# Altium schematic sheet 4.RK3588_GND.SchDoc
size A4; SheetNumber: 4; SheetTotal: 21
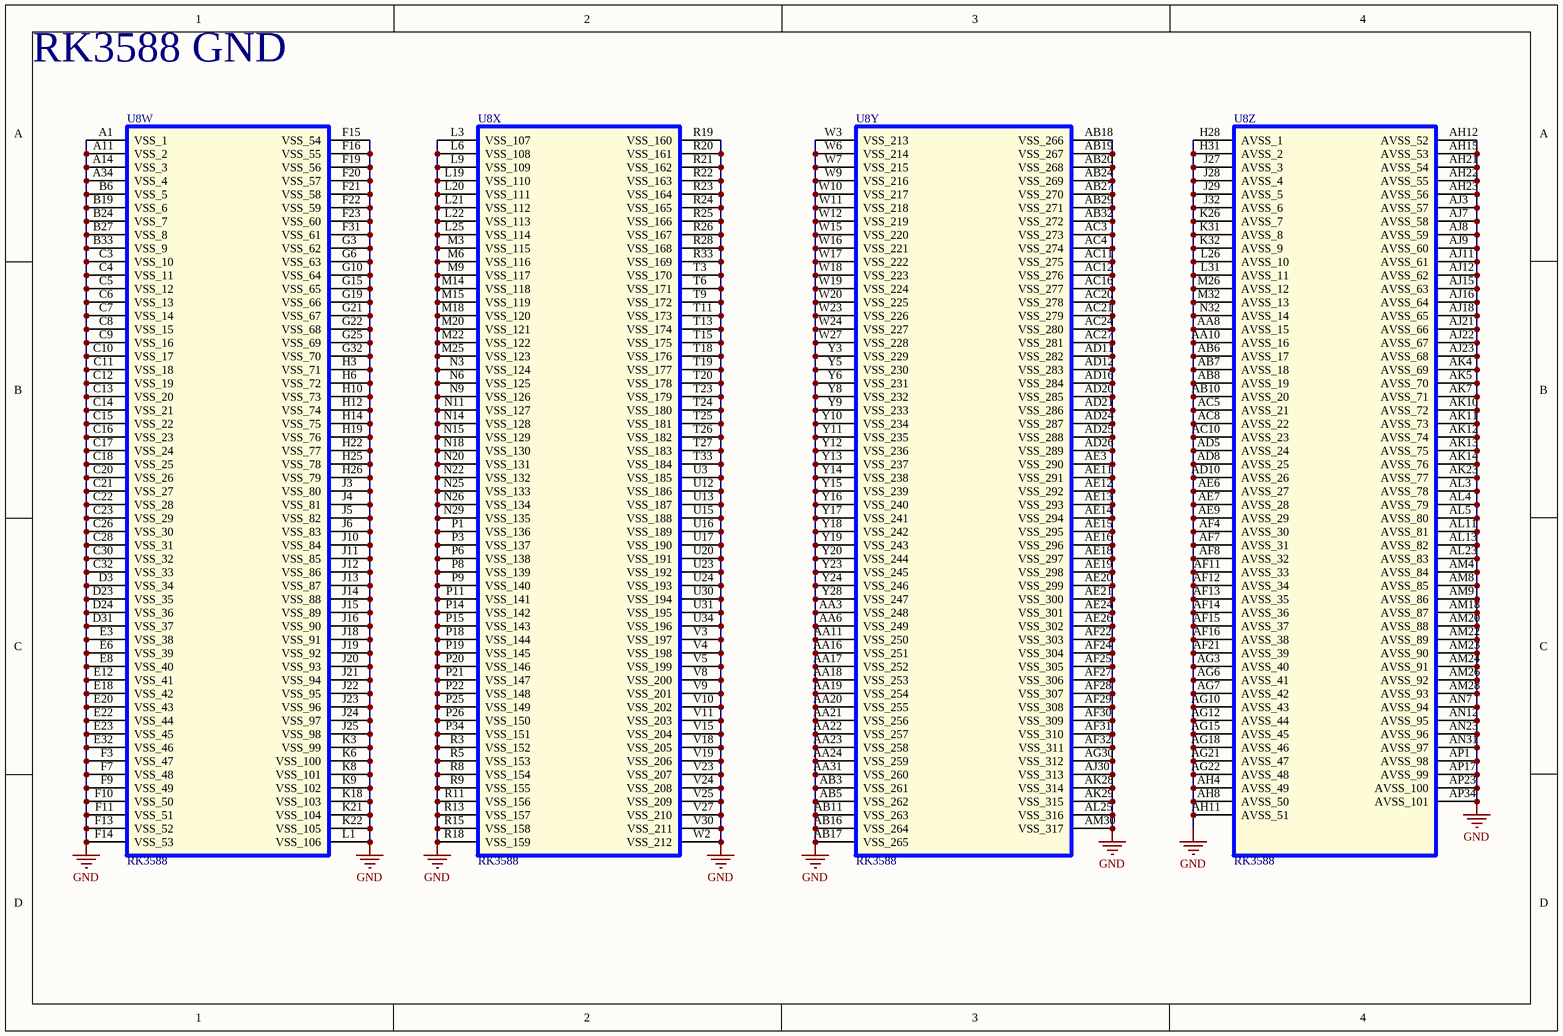
[diagram p0: 4.RK3588_GND.SchDoc]

## Parts
U8  RK3588  [BGA1088_23R00X23R00X2R00]  (parts W,X,Y,Z of 26)

## Nets
GND: U8.A1(VSS_1) U8.A11(VSS_2) U8.A14(VSS_3) U8.A34(VSS_4) U8.AA3(VSS_248) U8.AA6(VSS_249) U8.AA8(AVSS_15) U8.AA10(AVSS_16) U8.AA11(VSS_250) U8.AA16(VSS_251) U8.AA17(VSS_252) U8.AA18(VSS_253) U8.AA19(VSS_254) U8.AA20(VSS_255) U8.AA21(VSS_256) U8.AA22(VSS_257) U8.AA23(VSS_258) U8.AA24(VSS_259) U8.AA31(VSS_260) U8.AB3(VSS_261) U8.AB5(VSS_262) U8.AB6(AVSS_17) U8.AB7(AVSS_18) U8.AB8(AVSS_19) U8.AB10(AVSS_20) U8.AB11(VSS_263) U8.AB16(VSS_264) U8.AB17(VSS_265) U8.AB18(VSS_266) U8.AB19(VSS_267) U8.AB20(VSS_268) U8.AB24(VSS_269) U8.AB27(VSS_270) U8.AB29(VSS_271) U8.AB32(VSS_272) U8.AC3(VSS_273) U8.AC4(VSS_274) U8.AC5(AVSS_21) U8.AC8(AVSS_22) U8.AC10(AVSS_23) U8.AC11(VSS_275) U8.AC12(VSS_276) U8.AC16(VSS_277) U8.AC20(VSS_278) U8.AC21(VSS_279) U8.AC24(VSS_280) U8.AC27(VSS_281) U8.AD5(AVSS_24) U8.AD8(AVSS_25) U8.AD10(AVSS_26) U8.AD11(VSS_282) U8.AD12(VSS_283) U8.AD16(VSS_284) U8.AD20(VSS_285) U8.AD21(VSS_286) U8.AD24(VSS_287) U8.AD25(VSS_288) U8.AD26(VSS_289) U8.AE3(VSS_290) U8.AE6(AVSS_27) U8.AE7(AVSS_28) U8.AE9(AVSS_29) U8.AE11(VSS_291) U8.AE12(VSS_292) U8.AE13(VSS_293) U8.AE14(VSS_294) U8.AE15(VSS_295) U8.AE16(VSS_296) U8.AE18(VSS_297) U8.AE19(VSS_298) U8.AE20(VSS_299) U8.AE21(VSS_300) U8.AE24(VSS_301) U8.AE26(VSS_302) U8.AF4(AVSS_30) U8.AF7(AVSS_31) U8.AF8(AVSS_32) U8.AF11(AVSS_33) U8.AF12(AVSS_34) U8.AF13(AVSS_35) U8.AF14(AVSS_36) U8.AF15(AVSS_37) U8.AF16(AVSS_38) U8.AF21(AVSS_39) U8.AF22(VSS_303) U8.AF24(VSS_304) U8.AF25(VSS_305) U8.AF27(VSS_306) U8.AF28(VSS_307) U8.AF29(VSS_308) U8.AF30(VSS_309) U8.AF31(VSS_310) U8.AF32(VSS_311) U8.AG3(AVSS_40) U8.AG6(AVSS_41) U8.AG7(AVSS_42) U8.AG10(AVSS_43) U8.AG12(AVSS_44) U8.AG15(AVSS_45) U8.AG18(AVSS_46) U8.AG21(AVSS_47) U8.AG22(AVSS_48) U8.AG30(VSS_312) U8.AH4(AVSS_49) U8.AH8(AVSS_50) U8.AH11(AVSS_51) U8.AH12(AVSS_52) U8.AH15(AVSS_53) U8.AH21(AVSS_54) U8.AH22(AVSS_55) U8.AH23(AVSS_56) U8.AJ3(AVSS_57) U8.AJ7(AVSS_58) U8.AJ8(AVSS_59) U8.AJ9(AVSS_60) U8.AJ11(AVSS_61) U8.AJ12(AVSS_62) U8.AJ15(AVSS_63) U8.AJ16(AVSS_64) U8.AJ18(AVSS_65) U8.AJ21(AVSS_66) U8.AJ22(AVSS_67) U8.AJ23(AVSS_68) U8.AJ30(VSS_313) U8.AK4(AVSS_69) U8.AK5(AVSS_70) U8.AK7(AVSS_71) U8.AK10(AVSS_72) U8.AK11(AVSS_73) U8.AK12(AVSS_74) U8.AK13(AVSS_75) U8.AK14(AVSS_76) U8.AK23(AVSS_77) U8.AK28(VSS_314) U8.AK29(VSS_315) U8.AL3(AVSS_78) U8.AL4(AVSS_79) U8.AL5(AVSS_80) U8.AL11(AVSS_81) U8.AL13(AVSS_82) U8.AL23(AVSS_83) U8.AL25(VSS_316) U8.AM4(AVSS_84) U8.AM8(AVSS_85) U8.AM9(AVSS_86) U8.AM18(AVSS_87) U8.AM20(AVSS_88) U8.AM22(AVSS_89) U8.AM23(AVSS_90) U8.AM24(AVSS_91) U8.AM26(AVSS_92) U8.AM28(AVSS_93) U8.AM30(VSS_317) U8.AN7(AVSS_94) U8.AN12(AVSS_95) U8.AN23(AVSS_96) U8.AN31(AVSS_97) U8.AP1(AVSS_98) U8.AP17(AVSS_99) U8.AP23(AVSS_100) U8.AP34(AVSS_101) U8.B6(VSS_5) U8.B19(VSS_6) U8.B24(VSS_7) U8.B27(VSS_8) U8.B33(VSS_9) U8.C3(VSS_10) U8.C4(VSS_11) U8.C5(VSS_12) U8.C6(VSS_13) U8.C7(VSS_14) U8.C8(VSS_15) U8.C9(VSS_16) U8.C10(VSS_17) U8.C11(VSS_18) U8.C12(VSS_19) U8.C13(VSS_20) U8.C14(VSS_21) U8.C15(VSS_22) U8.C16(VSS_23) U8.C17(VSS_24) U8.C18(VSS_25) U8.C20(VSS_26) U8.C21(VSS_27) U8.C22(VSS_28) U8.C23(VSS_29) U8.C26(VSS_30) U8.C28(VSS_31) U8.C30(VSS_32) U8.C32(VSS_33) U8.D3(VSS_34) U8.D23(VSS_35) U8.D24(VSS_36) U8.D31(VSS_37) U8.E3(VSS_38) U8.E6(VSS_39) U8.E8(VSS_40) U8.E12(VSS_41) U8.E18(VSS_42) U8.E20(VSS_43) U8.E22(VSS_44) U8.E23(VSS_45) U8.E32(VSS_46) U8.F3(VSS_47) U8.F7(VSS_48) U8.F9(VSS_49) U8.F10(VSS_50) U8.F11(VSS_51) U8.F13(VSS_52) U8.F14(VSS_53) U8.F15(VSS_54) U8.F16(VSS_55) U8.F19(VSS_56) U8.F20(VSS_57) U8.F21(VSS_58) U8.F22(VSS_59) U8.F23(VSS_60) U8.F31(VSS_61) U8.G3(VSS_62) U8.G6(VSS_63) U8.G10(VSS_64) U8.G15(VSS_65) U8.G19(VSS_66) U8.G21(VSS_67) U8.G22(VSS_68) U8.G25(VSS_69) U8.G32(VSS_70) U8.H3(VSS_71) U8.H6(VSS_72) U8.H10(VSS_73) U8.H12(VSS_74) U8.H14(VSS_75) U8.H19(VSS_76) U8.H22(VSS_77) U8.H25(VSS_78) U8.H26(VSS_79) U8.H28(AVSS_1) U8.H31(AVSS_2) U8.J3(VSS_80) U8.J4(VSS_81) U8.J5(VSS_82) U8.J6(VSS_83) U8.J10(VSS_84) U8.J11(VSS_85) U8.J12(VSS_86) U8.J13(VSS_87) U8.J14(VSS_88) U8.J15(VSS_89) U8.J16(VSS_90) U8.J18(VSS_91) U8.J19(VSS_92) U8.J20(VSS_93) U8.J21(VSS_94) U8.J22(VSS_95) U8.J23(VSS_96) U8.J24(VSS_97) U8.J25(VSS_98) U8.J27(AVSS_3) U8.J28(AVSS_4) U8.J29(AVSS_5) U8.J32(AVSS_6) U8.K3(VSS_99) U8.K6(VSS_100) U8.K8(VSS_101) U8.K9(VSS_102) U8.K18(VSS_103) U8.K21(VSS_104) U8.K22(VSS_105) U8.K26(AVSS_7) U8.K31(AVSS_8) U8.K32(AVSS_9) U8.L1(VSS_106) U8.L3(VSS_107) U8.L6(VSS_108) U8.L9(VSS_109) U8.L19(VSS_110) U8.L20(VSS_111) U8.L21(VSS_112) U8.L22(VSS_113) U8.L25(VSS_114) U8.L26(AVSS_10) U8.L31(AVSS_11) U8.M3(VSS_115) U8.M6(VSS_116) U8.M9(VSS_117) U8.M14(VSS_118) U8.M15(VSS_119) U8.M18(VSS_120) U8.M20(VSS_121) U8.M22(VSS_122) U8.M25(VSS_123) U8.M26(AVSS_12) U8.M32(AVSS_13) U8.N3(VSS_124) U8.N6(VSS_125) U8.N9(VSS_126) U8.N11(VSS_127) U8.N14(VSS_128) U8.N15(VSS_129) U8.N18(VSS_130) U8.N20(VSS_131) U8.N22(VSS_132) U8.N25(VSS_133) U8.N26(VSS_134) U8.N29(VSS_135) U8.N32(AVSS_14) U8.P1(VSS_136) U8.P3(VSS_137) U8.P6(VSS_138) U8.P8(VSS_139) U8.P9(VSS_140) U8.P11(VSS_141) U8.P14(VSS_142) U8.P15(VSS_143) U8.P18(VSS_144) U8.P19(VSS_145) U8.P20(VSS_146) U8.P21(VSS_147) U8.P22(VSS_148) U8.P25(VSS_149) U8.P26(VSS_150) U8.P34(VSS_151) U8.R3(VSS_152) U8.R5(VSS_153) U8.R8(VSS_154) U8.R9(VSS_155) U8.R11(VSS_156) U8.R13(VSS_157) U8.R15(VSS_158) U8.R18(VSS_159) U8.R19(VSS_160) U8.R20(VSS_161) U8.R21(VSS_162) U8.R22(VSS_163) U8.R23(VSS_164) U8.R24(VSS_165) U8.R25(VSS_166) U8.R26(VSS_167) U8.R28(VSS_168) U8.R33(VSS_169) U8.T3(VSS_170) U8.T6(VSS_171) U8.T9(VSS_172) U8.T11(VSS_173) U8.T13(VSS_174) U8.T15(VSS_175) U8.T18(VSS_176) U8.T19(VSS_177) U8.T20(VSS_178) U8.T23(VSS_179) U8.T24(VSS_180) U8.T25(VSS_181) U8.T26(VSS_182) U8.T27(VSS_183) U8.T33(VSS_184) U8.U3(VSS_185) U8.U12(VSS_186) U8.U13(VSS_187) U8.U15(VSS_188) U8.U16(VSS_189) U8.U17(VSS_190) U8.U20(VSS_191) U8.U23(VSS_192) U8.U24(VSS_193) U8.U30(VSS_194) U8.U31(VSS_195) U8.U34(VSS_196) U8.V3(VSS_197) U8.V4(VSS_198) U8.V5(VSS_199) U8.V8(VSS_200) U8.V9(VSS_201) U8.V10(VSS_202) U8.V11(VSS_203) U8.V15(VSS_204) U8.V18(VSS_205) U8.V19(VSS_206) U8.V23(VSS_207) U8.V24(VSS_208) U8.V25(VSS_209) U8.V27(VSS_210) U8.V30(VSS_211) U8.W2(VSS_212) U8.W3(VSS_213) U8.W6(VSS_214) U8.W7(VSS_215) U8.W9(VSS_216) U8.W10(VSS_217) U8.W11(VSS_218) U8.W12(VSS_219) U8.W15(VSS_220) U8.W16(VSS_221) U8.W17(VSS_222) U8.W18(VSS_223) U8.W19(VSS_224) U8.W20(VSS_225) U8.W23(VSS_226) U8.W24(VSS_227) U8.W27(VSS_228) U8.Y3(VSS_229) U8.Y5(VSS_230) U8.Y6(VSS_231) U8.Y8(VSS_232) U8.Y9(VSS_233) U8.Y10(VSS_234) U8.Y11(VSS_235) U8.Y12(VSS_236) U8.Y13(VSS_237) U8.Y14(VSS_238) U8.Y15(VSS_239) U8.Y16(VSS_240) U8.Y17(VSS_241) U8.Y18(VSS_242) U8.Y19(VSS_243) U8.Y20(VSS_244) U8.Y23(VSS_245) U8.Y24(VSS_246) U8.Y28(VSS_247)

## Notes on the sheet
- RK3588 GND

## Library data of the parts
U8 = SOC_RK3588: ROCKCHIP SOC